# EAGLE schematic papilio_cam_board (EAGLE 6.2)
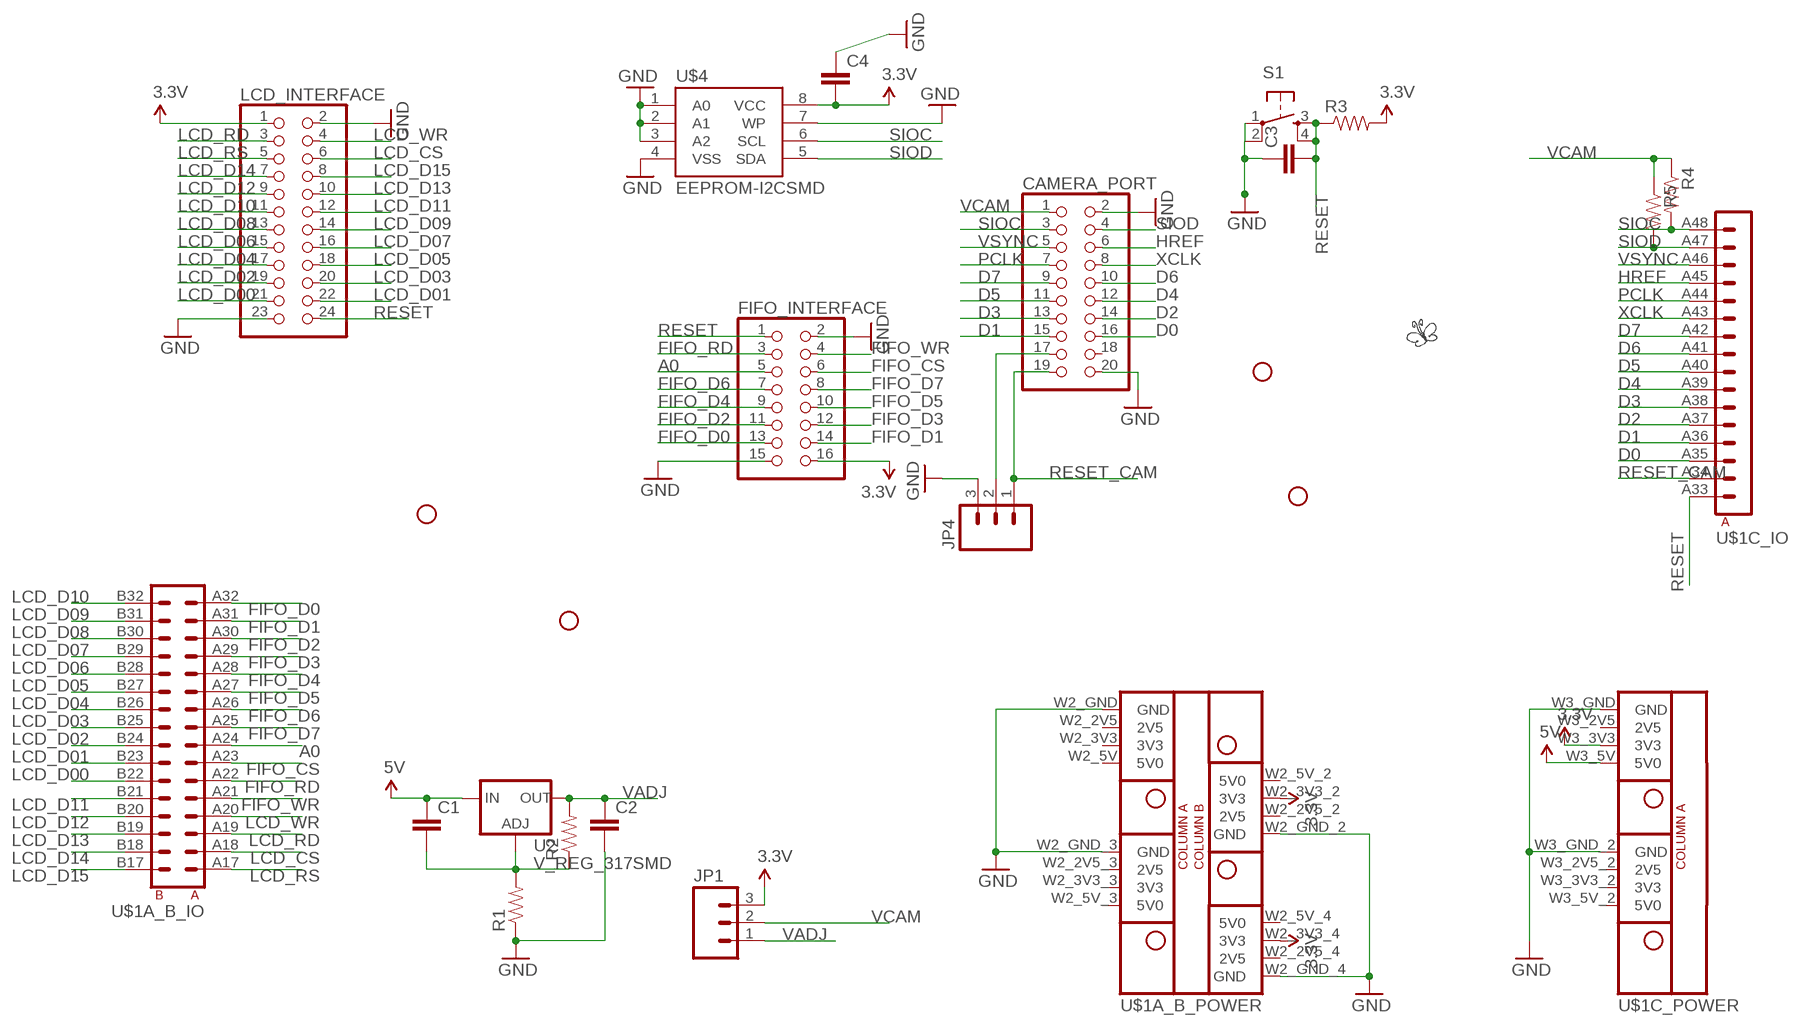
[diagram p0: schematic, sheet 1]

## Parts
C1  CAP0805  [0805]
C2  CAP0805  [0805]
C3  CAP0805  [0805]
C4  CAP0805  [0805]
CAMERA_PORT  PINHD-2X10  [2X10]
FIFO_INTERFACE  PINHD-2X8  [2X08]
JP1  M03PTH  [1X03]
JP2  STAND-OFF  [STAND-OFF]
JP3  STAND-OFF  [STAND-OFF]
JP4  M03PTH  [1X03]
JP5  STAND-OFF  [STAND-OFF]
JP7  STAND-OFF  [STAND-OFF]
LCD_INTERFACE  PINHD-2X12  [2X12]
LOGO1  BUTTERFLY_LOGO  [BUTTERFLY_LOGO]
R1  RESISTOR0805-RES  [0805]
R2  RESISTOR0805-RES  [0805]
R3  RESISTOR0805-RES  [0805]
R4  RESISTOR0805-RES  [0805]
R5  RESISTOR0805-RES  [0805]
S1  TAC_SWITCHSMD  [TACTILE_SWITCH_SMD]
U2  V_REG_317SMD  [SOT223]
U$1  MEGAWING_FULL_P1MEGAWING_P1  [MEGAWING_FULL_NOHOLES_P1]
U$4  EEPROM-I2CSMD  [SO08]

## Nets
3.3V: C4.2 FIFO_INTERFACE.16 JP1.3 LCD_INTERFACE.1 R3.2 U$1.W2_3V3_2(A_B_POWER:3V3) U$1.W2_3V3_4(A_B_POWER:3V3) U$1.W3_3V3(C_POWER:3V3) U$4.8(VCC)
5V: C1.1 U2.3(IN) U$1.W3_5V(C_POWER:5V0)
A0: FIFO_INTERFACE.5 U$1.A24(A_B_IO:A8)
D0: CAMERA_PORT.16 U$1.A35(C_IO:A3)
D1: CAMERA_PORT.15 U$1.A36(C_IO:A4)
D2: CAMERA_PORT.14 U$1.A37(C_IO:A5)
D3: CAMERA_PORT.13 U$1.A38(C_IO:A6)
D4: CAMERA_PORT.12 U$1.A39(C_IO:A7)
D5: CAMERA_PORT.11 U$1.A40(C_IO:A8)
D6: CAMERA_PORT.10 U$1.A41(C_IO:A9)
D7: CAMERA_PORT.9 U$1.A42(C_IO:A10)
FIFO_CS: FIFO_INTERFACE.6 U$1.A23(A_B_IO:A7)
FIFO_D0: FIFO_INTERFACE.13 U$1.A32(A_B_IO:A16)
FIFO_D1: FIFO_INTERFACE.14 U$1.A31(A_B_IO:A15)
FIFO_D2: FIFO_INTERFACE.11 U$1.A30(A_B_IO:A14)
FIFO_D3: FIFO_INTERFACE.12 U$1.A29(A_B_IO:A13)
FIFO_D4: FIFO_INTERFACE.9 U$1.A28(A_B_IO:A12)
FIFO_D5: FIFO_INTERFACE.10 U$1.A27(A_B_IO:A11)
FIFO_D6: FIFO_INTERFACE.7 U$1.A26(A_B_IO:A10)
FIFO_D7: FIFO_INTERFACE.8 U$1.A25(A_B_IO:A9)
FIFO_RD: FIFO_INTERFACE.3 U$1.A22(A_B_IO:A6)
FIFO_WR: FIFO_INTERFACE.4 U$1.A21(A_B_IO:A5)
GND: C2.2 C3.1 C4.1 CAMERA_PORT.2 CAMERA_PORT.20 FIFO_INTERFACE.2 FIFO_INTERFACE.15 JP4.3 LCD_INTERFACE.2 LCD_INTERFACE.23 R1.1 S1.1 S1.2 U$1.W2_GND(A_B_POWER:GND) U$1.W2_GND_2(A_B_POWER:GND) U$1.W2_GND_3(A_B_POWER:GND) U$1.W2_GND_4(A_B_POWER:GND) U$1.W3_GND(C_POWER:GND) U$1.W3_GND_2(C_POWER:GND) U$4.1(A0) U$4.2(A1) U$4.3(A2) U$4.4(VSS) U$4.7(WP)
HREF: CAMERA_PORT.6 U$1.A45(C_IO:A13)
LCD_CS: LCD_INTERFACE.6 U$1.A18(A_B_IO:A2)
LCD_D00: LCD_INTERFACE.21 U$1.B22(A_B_IO:B6)
LCD_D01: LCD_INTERFACE.22 U$1.B23(A_B_IO:B7)
LCD_D02: LCD_INTERFACE.19 U$1.B24(A_B_IO:B8)
LCD_D03: LCD_INTERFACE.20 U$1.B25(A_B_IO:B9)
LCD_D04: LCD_INTERFACE.17 U$1.B26(A_B_IO:B10)
LCD_D05: LCD_INTERFACE.18 U$1.B27(A_B_IO:B11)
LCD_D06: LCD_INTERFACE.15 U$1.B28(A_B_IO:B12)
LCD_D07: LCD_INTERFACE.16 U$1.B29(A_B_IO:B13)
LCD_D08: LCD_INTERFACE.13 U$1.B30(A_B_IO:B14)
LCD_D09: LCD_INTERFACE.14 U$1.B31(A_B_IO:B15)
LCD_D10: LCD_INTERFACE.11 U$1.B32(A_B_IO:B16)
LCD_D11: LCD_INTERFACE.12 U$1.B21(A_B_IO:B5)
LCD_D12: LCD_INTERFACE.9 U$1.B20(A_B_IO:B4)
LCD_D13: LCD_INTERFACE.10 U$1.B19(A_B_IO:B3)
LCD_D14: LCD_INTERFACE.7 U$1.B18(A_B_IO:B2)
LCD_D15: LCD_INTERFACE.8 U$1.B17(A_B_IO:B1)
LCD_RD: LCD_INTERFACE.3 U$1.A19(A_B_IO:A3)
LCD_RS: LCD_INTERFACE.5 U$1.A17(A_B_IO:A1)
LCD_WR: LCD_INTERFACE.4 U$1.A20(A_B_IO:A4)
N$1: C1.2 R1.2 R2.1 U2.1(ADJ)
N$2: CAMERA_PORT.17 JP4.2
PCLK: CAMERA_PORT.7 U$1.A44(C_IO:A12)
RESET: C3.2 FIFO_INTERFACE.1 LCD_INTERFACE.24 R3.1 S1.3 S1.4 U$1.A33(C_IO:A1)
RESET_CAM: CAMERA_PORT.19 JP4.1 U$1.A34(C_IO:A2)
SIOC: CAMERA_PORT.3 R4.2 U$1.A48(C_IO:A16) U$4.6(SCL)
SIOD: CAMERA_PORT.4 R5.2 U$1.A47(C_IO:A15) U$4.5(SDA)
VADJ: C2.1 JP1.1 R2.2 U2.2(OUT)
VCAM: CAMERA_PORT.1 JP1.2 R4.1 R5.1
VSYNC: CAMERA_PORT.5 U$1.A46(C_IO:A14)
XCLK: CAMERA_PORT.8 U$1.A43(C_IO:A11)
Unconnected: CAMERA_PORT.18 U$1.W2_2V5(A_B_POWER:2V5) U$1.W2_2V5_2(A_B_POWER:2V5) U$1.W2_2V5_3(A_B_POWER:2V5) U$1.W2_2V5_4(A_B_POWER:2V5) U$1.W2_3V3(A_B_POWER:3V3) U$1.W2_3V3_3(A_B_POWER:3V3) U$1.W2_5V(A_B_POWER:5V0) U$1.W2_5V_2(A_B_POWER:5V0) U$1.W2_5V_3(A_B_POWER:5V0) U$1.W2_5V_4(A_B_POWER:5V0) U$1.W3_2V5(C_POWER:2V5) U$1.W3_2V5_2(C_POWER:2V5) U$1.W3_3V3_2(C_POWER:3V3) U$1.W3_5V_2(C_POWER:5V0)

## Library data of the parts
C1-C4 = SparkFun:CAP: Capacitor Standard 0603 ceramic capacitor, and 0.1" leaded capacitor.
CAMERA_PORT = pinhead:PINHD-2X10: PIN HEADER
FIFO_INTERFACE = pinhead:PINHD-2X8: PIN HEADER
JP1 JP4 = SparkFun:M03: Header 3 Standard 3-pin 0.1" header. Use with straight break away headers (SKU : PRT-00116), right angle break away headers (PRT-00553), swiss pins (PRT-00743), machine pins (PRT-00117), and female headers (PRT-00115). Molex polarized connector foot print use with SKU : PRT-08232 with associated crimp pins and housings.
JP2 JP3 JP5 JP7 = SparkFun:STAND-OFF: Stand Off This is the mechanical footprint for a #4 phillips button head screw. Use the keepout ring to avoid running the screw head into surrounding components. SKU : PRT-00447
LCD_INTERFACE = pinhead:PINHD-2X12: PIN HEADER
LOGO1 = Papilio:BUTTERFLY_LOGO
R1-R5 = SparkFun:RESISTOR: Resistor Basic schematic elements and footprints for 0603, 1206, and PTH resistors.
S1 = SparkFun:TAC_SWITCH: Momentary Switch Button commonly used for reset or general input. Spark Fun Electronics SKU : COM-00097
U2 = SparkFun:V_REG_317: Voltage Regulator Standard LM317 adjustable voltage regulator. AOI (Adjust Output Input). Google 'LM317 Calculator' for easy to use app to get the two resistor values needed. 240/720 for 5V output. 240/390 for 3.3V output. Spark Fun Electronics SKU : COM-00527
U$1 = Papilio:MEGAWING_FULL_P1
U$4 = SparkFun:EEPROM-I2C